# Altium schematic sheet SALO_CONTROLLER_PCB.SchDoc
size A
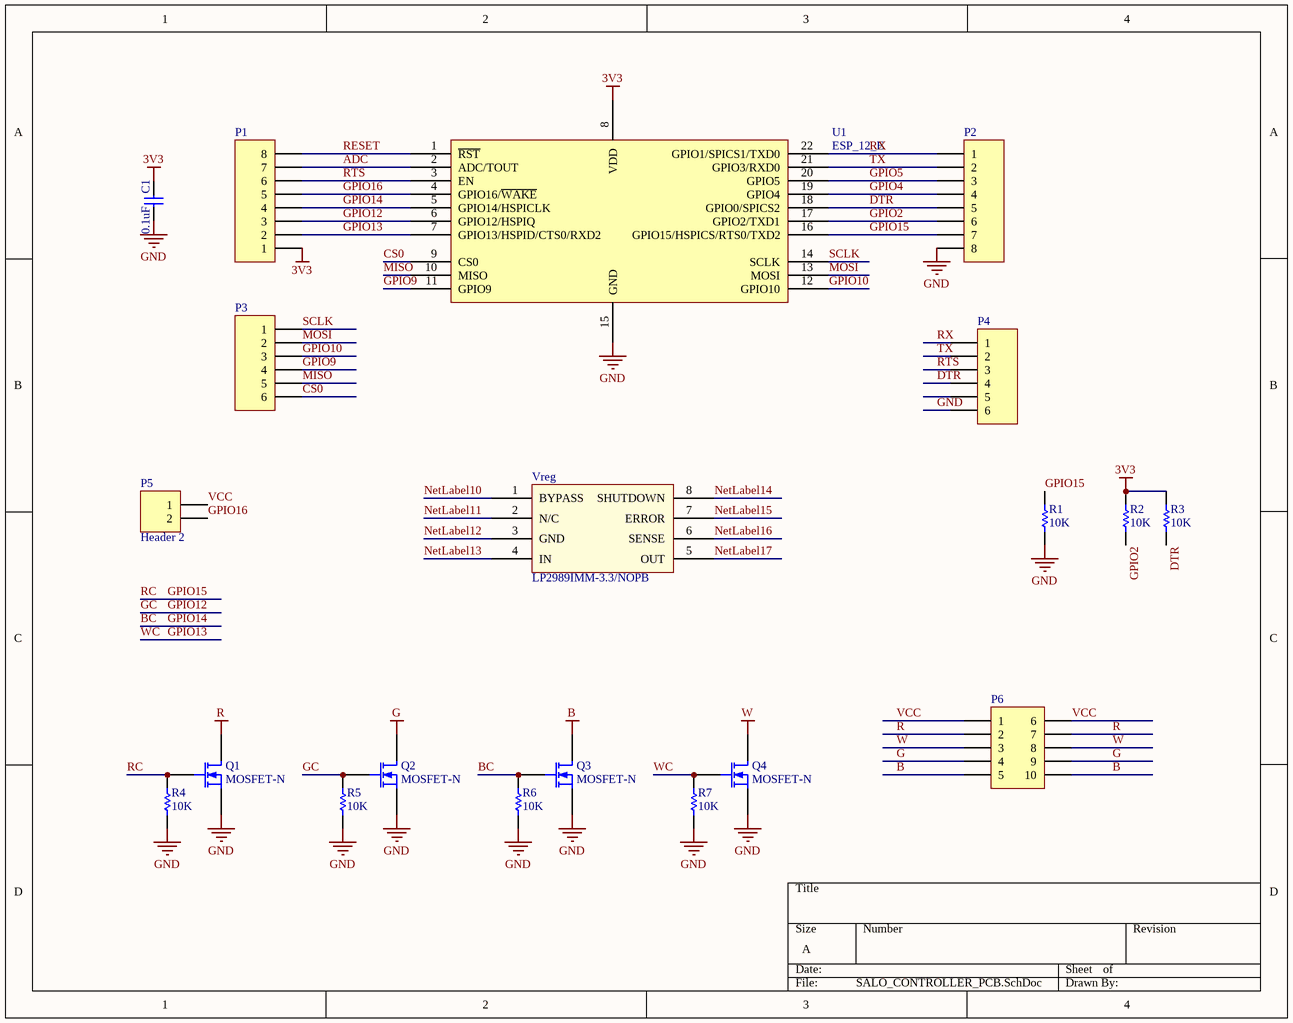
[diagram p0: SALO_CONTROLLER_PCB.SchDoc]

## Parts
C1  0.1uF  [CAPC1608X06L]
P1  Header 8  [HDR1X8]  (value not drawn)
P2  Header 8  [HDR1X8]  (value not drawn)
P3  Header 6  [HDR1X6]  (value not drawn)
P4  Header 6  [HDR1X6]  (value not drawn)
P5  Header 2  [HDR1X2]
P6  Header 5X2A  [HDR2X5_CEN]  (value not drawn)
Q1  MOSFET-N  [DPAK]
Q2  MOSFET-N  [DPAK]
Q3  MOSFET-N  [DPAK]
Q4  MOSFET-N  [DPAK]
R1  value 10K  [R0805]  (hidden comment: Res1)
R2  value 10K  [R0805]  (hidden comment: Res1)
R3  value 10K  [R0805]  (hidden comment: Res1)
R4  value 10K  [R0805]  (hidden comment: Res1)
R5  value 10K  [R0805]  (hidden comment: Res1)
R6  value 10K  [R0805]  (hidden comment: Res1)
R7  value 10K  [R0805]  (hidden comment: Res1)
U1  ESP_12_E  [ESP_12_E]
Vreg  LP2989IMM-3.3/NOPB  [MSOP-8]

## Nets
3V3: C1.2 P1.1 R2.2 R3.2 U1.8(VDD)
B: P6.5 P6.10 Q3.1(D)
G: P6.4 P6.9 Q2.1(D)
GND: C1.1 P2.8 P4.6 Q1.3(S) Q2.3(S) Q3.3(S) Q4.3(S) R1.1 R4.1 R5.1 R6.1 R7.1 U1.15(GND)
R: P6.2 P6.7 Q1.1(D)
W: P6.3 P6.8 Q4.1(D)
ADC: P1.7 U1.2(ADC/TOUT)
BC: P1.4 Q3.2(G) R6.2 U1.5(GPIO14/HSPICLK)  [also labelled GPIO14]
CS0: P3.6 U1.9(CS0)
DTR: P2.5 P4.4 R3.1 U1.18(GPIO0/SPICS2)
GC: P1.3 Q2.2(G) R5.2 U1.6(GPIO12/HSPIQ)  [also labelled GPIO12]
GPIO2: P2.6 R2.1 U1.17(GPIO2/TXD1)
GPIO4: P2.4 U1.19(GPIO4)
GPIO5: P2.3 U1.20(GPIO5)
GPIO9: P3.4 U1.11(GPIO9)
GPIO10: P3.3 U1.12(GPIO10)
GPIO13: P1.2 Q4.2(G) R7.2 U1.7(GPIO13/HSPID/CTS0/RXD2)  [also labelled WC]
GPIO15: P2.7 Q1.2(G) R1.2 R4.2 U1.16(GPIO15/HSPICS/RTS0/TXD2)  [also labelled RC]
GPIO16: P1.5 P5.2 U1.4(GPIO16/~{WAKE})
MISO: P3.5 U1.10(MISO)
MOSI: P3.2 U1.13(MOSI)
NetLabel10: Vreg.1(BYPASS)
NetLabel11: Vreg.2(N/C)
NetLabel12: Vreg.3(GND)
NetLabel13: Vreg.4(IN)
NetLabel14: Vreg.8(SHUTDOWN)
NetLabel15: Vreg.7(ERROR)
NetLabel16: Vreg.6(SENSE)
NetLabel17: Vreg.5(OUT)
RESET: P1.8 U1.1(~{RST})
RTS: P1.6 P4.3 U1.3(EN)
RX: P2.1 P4.1 U1.22(GPIO1/SPICS1/TXD0)
SCLK: P3.1 U1.14(SCLK)
TX: P2.2 P4.2 U1.21(GPIO3/RXD0)
VCC: P5.1 P6.1 P6.6

Not connected (* = marked no-connect by the designer): P4 5

## Library data of the parts
C1 = CAP_0603: Capacitor, X5R, ±10%; Part Number: C0603-4µ7; Value: 4.7µF; Note: 6.3V; Artikkelnr Noca: 20069060; Artikkelnr Simpro: N.A.; Manufacturer: *; Manufacturer Part Number: *; Datasheet: *; LatestRevisionDate: 2009-11-23; Pin Count: 2; Publisher: Nordic Semiconductor; Published: 2009-05-08; Supplier: *; Supplier part number: *; 2nd source Supplier: *; 2nd source part number: *; Footprint Doc: 0603
P1 P2 = Header 8: Header, 8-Pin; LatestRevisionDate: 17-Jul-2002; LatestRevisionNote: Re-released for DXP Platform.; Publisher: Altium Limited
P3 P4 = Header 6: Header, 6-Pin; LatestRevisionDate: 17-Jul-2002; LatestRevisionNote: Re-released for DXP Platform.; Publisher: Altium Limited
P5 = Header 2: Header, 2-Pin; LatestRevisionDate: 17-Jul-2002; LatestRevisionNote: Re-released for DXP Platform.; Publisher: Altium Limited
P6 = Header 5X2A: Header, 5-Pin, Dual row; LatestRevisionDate: 17-Jul-2002; LatestRevisionNote: Re-released for DXP Platform.; Publisher: Altium Limited
Q1-Q4 = MOSFET-N: N-Channel MOSFET
R1-R7 = Res1: Resistor; Published: 8-Jun-2000; LatestRevisionDate: 17-Jul-2002; LatestRevisionNote: Re-released for DXP Platform.; PackageReference: AXIAL-0.3; Publisher: Altium Limited; PackageDescription: Axial Device, Thru-Hole; 2 Leads; 0.3 in Pin Spacing
U1 = ESP_12_E: ESP-12 Wi-Fi Module by AI-Thinker; IC: ESP8266-EX; Vendor: Ai-thinker
Vreg = LP2989IMM-3.3/NOPB: 3.3Vout 500mA Voltage Regulator; Datasheet: LP2989IMM-3.3/NOPB; Supplier 1: Farnell